# Altium schematic sheet Sch_Figures.SchDoc
size A3; Author: Michael Carpenter; DocumentNumber: 1; SheetNumber: 1; SheetTotal: 2
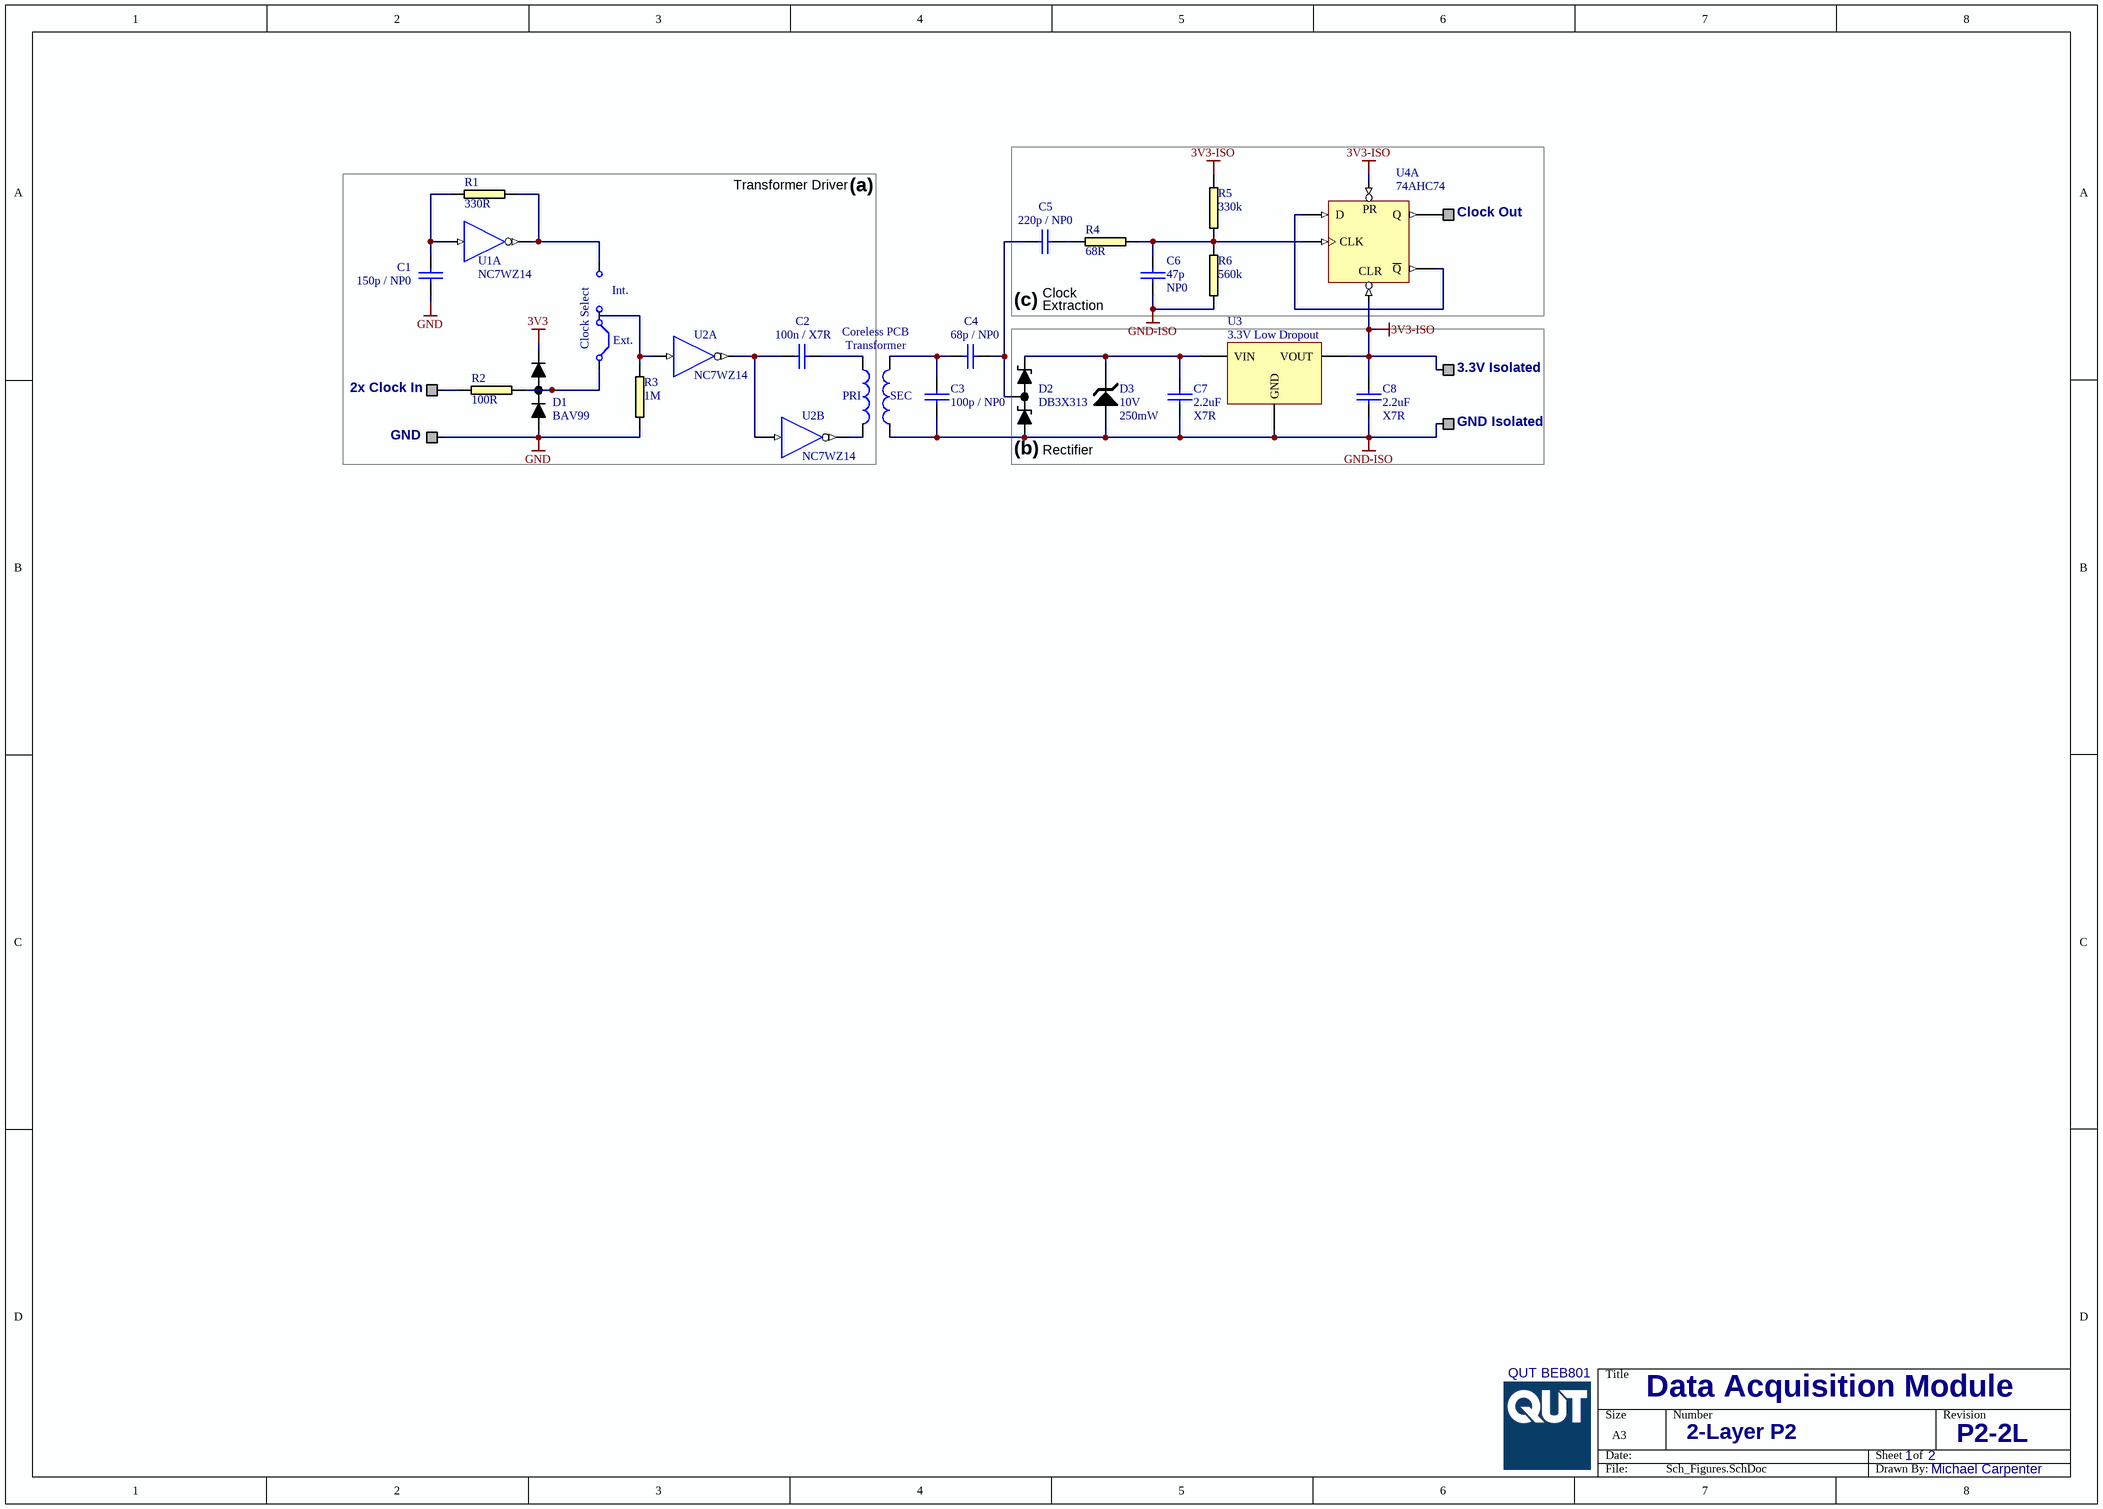
[diagram p0: Sch_Figures.SchDoc]

## Parts
C1  150p / NP0  [0603]
C2  100n / X7R  [0805]
C3  100p / NP0  [0603]
C4  68p / NP0  [0603]
C5  220p / NP0  [0603]
C6  47p  [0603]
C7  2.2uF  [0805]
C8  2.2uF  [0805]
D1  BAV99  [SOT-23]
D2  DB3X313  [SOT-23]
D3  10V  [SOD-123/323]
J1  Clock Select  [3-Way_Jumper_Pad]  (no BOM)
L1  PRI  [Planar_PCB_Spiral]  (net tie, no BOM)
L2  SEC  [Planar_PCB_Spiral]  (net tie, no BOM)
PIN1  2x Clock In
PIN2  GND
PIN3  3.3V Isolated
PIN4  GND Isolated
PIN8  Clock Out
R1  330R  [0603]
R2  100R  [0603]
R3  1M  [0603]
R4  68R  [0603]
R5  330k  [0603]
R6  560k  [0603]
U1  NC7WZ14  [SC70]  (part A of 2)
U2  NC7WZ14  [SC70]  (parts A,B of 2)
U3  3.3V Low Dropout  [SOT23-5]
U4  74AHC74  [646-06]  (part A of 2)

## Blocks framed on the sheet
(a): C1 C2 D1 J1 L1 PIN1 PIN2 R1-R3 U1 U2
(c): C5 C6 PIN8 R4-R6 U4

## Nets
3V3: D1.2
3V3-ISO: C8.1 PIN3.1 R5.1 U3.5(VOUT) U4.1(CLR) U4.4(PR)
GND: C1.2 D1.1 PIN2.1 R3.2 U4.7(GND)
GND-ISO: C3.1 C6.1 C7.2 C8.2 D2.4 D3.A L2.1 PIN4.1 R6.2 U3.2(GND)
VDD: U4.14(VDD)
NetC1_1: C1.1 R1.2 U1.1(1A)
NetC2_1: C2.1 L1.2
NetC2_2: C2.2 U2.3(2A) U2.6(1~{Y})
NetC3_2: C3.2 C4.1 L2.2
NetC4_2: C4.2 C5.1 D2.3
NetC5_2: C5.2 R4.2
NetC6_2: C6.2 R4.1 R5.2 R6.1 U4.3(CLK)
NetC7_1: C7.1 D2.5 D3.K U3.1(VIN)
NetD1_3: D1.3 J1.3 R2.1
NetJ1_1: J1.1 R1.1 U1.6(1~{Y})
NetJ1_2: J1.2(Com) R3.1 U2.1(1A)
NetL1_1: L1.1 U2.4(2~{Y})
NetPIN1_1: PIN1.1 R2.2
NetPIN8_1: PIN8.1 U4.5(Q)
NetU4_2: U4.2(D) U4.6(~{Q})

Not connected (* = marked no-connect by the designer): U1 2(GND) 5(VCC); U2 2(GND) 5(VCC); U3 3(EN) 4(BYP)

## Notes on the sheet
- Transformer Driver
- (near J1) Int.
- Clock
- Extraction
- (near J1) Ext.
- Coreless PCB
  Transformer
- (near D2) (b)
- Rectifier
- QUT BEB801
- Data Acquisition Module
- 2-Layer P2
- P2-2L
- (in symbol CAP-STD-SM) X7R; NP0
- (in symbol ZENER-SM) 250mW

## Library data of the parts
C1-C8 = CAP-STD-SM: Capacitor - S/M; Manuf.Code: *
D1 = BAV-99: 3 Pin Dual Diode S/M
D2 = DB3X313: 3 Pin Dual Schottky Diode S/M
D3 = ZENER-SM: Zener Diode - S/M; DK PN: MM3Z10VT1GOSCT-ND
J1 = 3-Way_Solder_Jumper_1: Solder-Bridge Jumper Pad - Setting style 1; State: BRIDGED
L1 L2 = Inductor: Code_IEC: 1005; Value: 10mH; Published: 8-Jun-2000; LatestRevisionDate: 29-May-2009; LatestRevisionNote: IPC-7351 Footprint Added.; PackageReference: 0402-A; Publisher: Altium Limited; PackageDescription: Chip Inductor; Code_JEITA: 0402
PIN1-PIN4 PIN8 = DAQM_Terminal: Terminal of DAQM Module - may be castellated via or square test pin
R1-R6 = RES-SM: Resistor - S/M
U1 U2 = NC7WZ14: Dual Fast Schmitt Trigger; DK PN: NC7WZ14P6XCT-ND
U3 = AP2202K-3.3: 3.3V 150mA LDO
U4 = MC74HC74AN: Dual D-Type Flip-Flop with Set and Reset; Published: 15-Apr-2002; DatasheetVersion: Mar-2000; PackageVersion: 1995; PackageReference: 646-06; Publisher: Altium Limited; PackageDescription: DIP; 14 Leads; Row Spacing 7.62 mm; Pitch 2.54 mm; ComponentLink1Description: Manufacturer Link; ComponentLink1URL: http://www.onsemi.com/; ComponentLink2Description: Datasheet; ComponentLink2URL: http://www.onsemi.com/pub/Collateral/MC74HC74A-D.PDF